# Altium schematic sheet Microcontroller.SchDoc
size A4; SheetNumber: 2; SheetTotal: 6
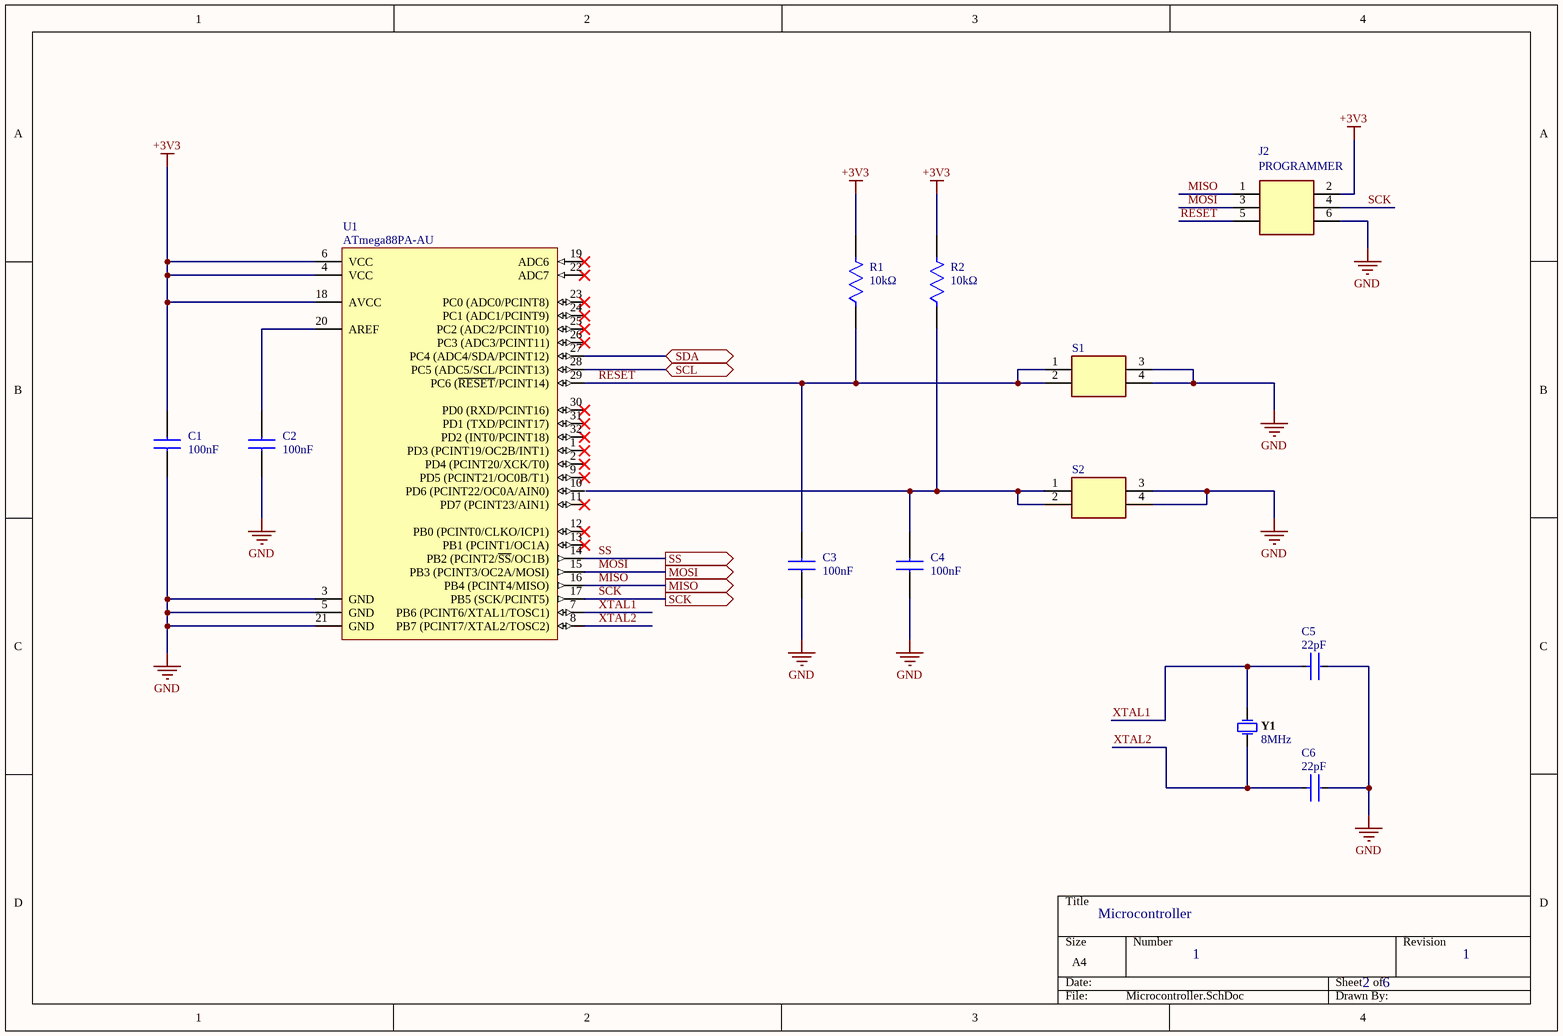
[diagram p0: Microcontroller.SchDoc]

## Parts
C1  value 100nF  [CAPC2013X137N]  (hidden comment: 0805B104K500NT)
C2  value 100nF  [CAPC2013X137N]  (hidden comment: 0805B104K500NT)
C3  value 100nF  [CAPC2013X137N]  (hidden comment: 0805B104K500NT)
C4  value 100nF  [CAPC2013X137N]  (hidden comment: 0805B104K500NT)
C5  Capacitance: 22pF  [FP-0805-L_2_01_0_2-W_1_25-IPC_A]  (hidden comment: 08051A220K4T2A)
C6  Capacitance: 22pF  [FP-0805-L_2_01_0_2-W_1_25-IPC_A]  (hidden comment: 08051A220K4T2A)
J2  Name: PROGRAMMER  [HDRV6W90P254_2X3_762X500X560P]  (hidden comment: 90131-0763)
R1  value 10kΩ  [FP-CR0805-IPC_A]  (hidden comment: CR0805-FX-1002ELF)
R2  value 10kΩ  [FP-CR0805-IPC_A]  (hidden comment: CR0805-FX-1002ELF)
S1  1301.9315.24  [13019319]  (value not drawn)
S2  1301.9315.24  [13019319]  (value not drawn)
U1  ATmega88PA-AU  [32A_L]
Y1  value 8MHz  [FOX-FOXSLF080-20]  (hidden comment: FOXSLF/080-20)

## Ports
MISO (out, see Encode Schematic[4B]), MOSI (out, see Encode Schematic[4B]), SCK (out, see Encode Schematic[4B]), SCL (bidir, see Encode Schematic[3B], Hall Effect IC[3B]), SDA (bidir, see Encode Schematic[3B], Hall Effect IC[3B]), SS (out, see Encode Schematic[4C])

## Nets
+3V3: C1.1 J2.2 R1.2 R2.2 U1.4(VCC) U1.6(VCC) U1.18(AVCC)
GND: C1.2 C2.2 C3.2 C4.2 C5.2 C6.2 J2.6 S1.3(COM_1) S1.4(COM_2) S2.3(COM_1) S2.4(COM_2) U1.3(GND) U1.5(GND) U1.21(GND)
MISO: J2.1 U1.16(PB4_(PCINT4/MISO)) ; port MISO
MOSI: J2.3 U1.15(PB3_(PCINT3/OC2A/MOSI)) ; port MOSI
RESET: C3.1 J2.5 R1.1 S1.1(NO_1) S1.2(NO_2) U1.29(PC6_(~{RESET}/PCINT14))
SCK: J2.4 U1.17(PB5_(SCK/PCINT5)) ; port SCK
SCL: U1.28(PC5_(ADC5/SCL/PCINT13)) ; port SCL
SDA: U1.27(PC4_(ADC4/SDA/PCINT12)) ; port SDA
SS: U1.14(PB2_(PCINT2/~{SS}/OC1B)) ; port SS
XTAL1: C5.1 U1.7(PB6_(PCINT6/XTAL1/TOSC1)) Y1.2
XTAL2: C6.1 U1.8(PB7_(PCINT7/XTAL2/TOSC2)) Y1.1
NetC2_1: C2.1 U1.20(AREF)
NetC4_1: C4.1 R2.1 S2.1(NO_1) S2.2(NO_2)

Not connected (* = marked no-connect by the designer): U1 1(PD3_(PCINT19/OC2B/INT1))* 2(PD4_(PCINT20/XCK/T0))* 9(PD5_(PCINT21/OC0B/T1))* 10(PD6_(PCINT22/OC0A/AIN0)) 11(PD7_(PCINT23/AIN1))* 12(PB0_(PCINT0/CLKO/ICP1))* 13(PB1_(PCINT1/OC1A))* 19(ADC6)* 22(ADC7)* 23(PC0_(ADC0/PCINT8))* 24(PC1_(ADC1/PCINT9))* 25(PC2_(ADC2/PCINT10))* 26(PC3_(ADC3/PCINT11))* 30(PD0_(RXD/PCINT16))* 31(PD1_(TXD/PCINT17))* 32(PD2_(INT0/PCINT18))*

## Notes on the sheet
- Microcontroller
- 1
- 2
- 6

## Library data of the parts
C1-C4 = 0805B104K500NT: Capacitor; Manufacturer_Name: Novacap; Datasheet Link: https://componentsearchengine.com/Datasheets/1/0805B104K500NT.pdf; Height: 1.37mm; Manufacturer_Part_Number: 0805B104K500NT; Mouser Part Number: 767-0805B104K500NT; Mouser Price/Stock: https://www.mouser.com/Search/Refine.aspx?Keyword=767-0805B104K500NT
C5 C6 = CMP-04427-002582-1: Automotive Ceramic Capacitor, 0805, 22pF, 10%, C0G, 30ppm/°C, 100V; Termination: SMD/SMT; Ratings: AEC-Q200; Construction: Flat; Packaging: Tape and Reel; Mount: Surface Mount; Case Code (Imperial): 0805; Radiation Hardening: No; Tolerance: 10%; Width: 1.2mm; Case/Package: 0805; Thickness: 0.037inch; Min Operating Temperature: -55°C; Dielectric: C0G; Voltage Rating: 100V; Series: -; Package Quantity: 4000; Depth: 1.25mm; Max Operating Temperature: 125°C; Voltage Rating (DC): 100V; Case Code (Metric): 2012; Number of Pins: 2; Length: 2.01mm; RoHS Compliant: Yes
J2 = 90131-0763: Connector; Manufacturer_Name: Molex; Datasheet Link: https://www.molex.com/pdm_docs/sd/901310763_sd.pdf; Height: 5.6mm; Manufacturer_Part_Number: 90131-0763; Mouser Part Number: 538-90131-0763; Mouser Price/Stock: https://www.mouser.co.uk/ProductDetail/Molex/90131-0763?qs=KObwnG1V4zuKPiIchrbqlw%3D%3D
R1 R2 = CMP-07231-003204-1: Thick Film Chip Resistors 0805 10kΩ 0.125W 1% 100ppm/°C; Max Power Dissipation: 125mW; Voltage Rating: 150V; Voltage Rating (DC): 100V; Resistance: 10kR; Height: 0.5mm; Tolerance: 1%; Max Operating Temperature: 155°C; Thickness: 508um; Radiation Hardening: No; Packaging: Tape and Reel; Depth: 1.25mm; Contact Plating: Tin; Package Quantity: 1; Case Code (Metric): 2012; REACH SVHC: No SVHC; Min Operating Temperature: -55°C; Power Rating: 125mW; Mount: Surface Mount; Length: 2mm; Case Code (Imperial): 0805; Width: 1.25mm; Temperature Coefficient: 100ppm/°C; Termination: SMD/SMT; Composition: Thick Film; Features: Moisture Resistant; Case/Package: 0805; Number of Terminations: 2
S1 S2 = 1301.9315.24: Switch; Manufacturer_Name: SCHURTER; Datasheet Link: https://www.schurter.com/en/datasheet/typ_6x6_mm_tact_switches.pdf; Height: 9mm; Manufacturer_Part_Number: 1301.9315.24; Mouser Part Number: 693-1301.9315.24; Mouser Price/Stock: https://www.mouser.co.uk/ProductDetail/Schurter/1301.9315.24?qs=wYWahoWfBn9TJM14ZGQ%2Fug%3D%3D; Arrow Part Number: 1301.9315.24; Arrow Price/Stock: https://www.arrow.com/en/products/1301.9315.24/schurter?region=europe
U1 = CMP-0095-00213-2: 8-bit AVR Microcontroller, 8KB Flash, 512 Bytes EEPROM, 1KB SRAM, 32-pin TQFP, Industrial Grade (-40°C to 85°C); PackageReference: 32A; PackageDescription: 32-Lead, 7x7x1.0 mm Body, 0.8mm Lead Pitch, Thin Profile Plastic Quad Flat Package (TQFP); ComponentLink2Description: ATmega48A/48PA/88A/88PA/168A/168PA/328/328P Datasheet; ComponentLink3URL: http://www.atmel.com/dyn/resources/prod_documents/8271S.pdf; ComponentLink3Description: ATmega48A/48PA/88A/88PA/168A/168PA/328/328P Summary; PackageVersion: revC, Oct-2010; RevisionNote: DatasheetVersion & PackageVersion updated. URLs added.; DatasheetVersion: revD, May-2011; ComponentLink1URL: http://www.atmel.com/; ComponentLink2URL: http://www.atmel.com/dyn/resources/prod_documents/doc8271.pdf; Code_JEDEC: MS-026-ABA; ComponentLink1Description: Manufacturer URL
Y1 = CMP-1749-00002-1: Resistance Weld Thru-Hole Crystal, 8 MHz, -20 to 70 degC, 2-Pin THD, RoHS, Bulk; Dropout Voltage: 2 V; Outputs: 1; Nominal Output Voltage: 5 V; Min Input Voltage: 7 V; Case\Package: TO-263-3; Max Input Voltage: 35 V; Max Ouput Current: 1 A; Length: 10.24 mm; Max Operating Temperature: 125 degC; Mount: Surface Mount; PackageDescription: 2-Pin Through Hole Device, Body 11.35 x 4.65 mm; Package Quantity: 50; Pins: 3; ComponentLink2URL: http://download.siliconexpert.com/pdfs/2015/4/5/6/5/7/200/fox_/manual/35607121449963728hc49slf.pdf; PackageReference: FOXSLF080-20; Min Operating Temperature: 0 degC; Height: 30.02 mm; Packaging: Rail/Tube; Radiation Hardening: No; Width: 9.35 mm; ComponentLink1URL: http://www.foxonline.com/; DatasheetVersion: Mar-15; ComponentLink1Description: Manufacturer URL; Output Voltage: 5 V; RoHSCompliant: true; REACH SVHC: No SVHC; Output Current: 1 A; ComponentLink2Description: Datasheet